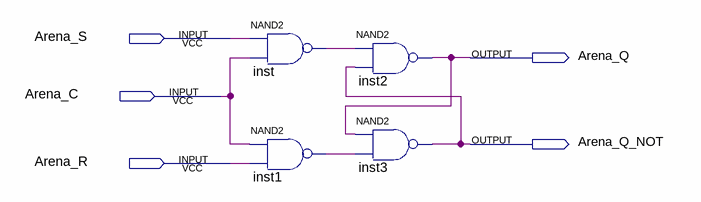
[diagram p0: schematic sheet]
// Quartus schematic Arena_Control_SRLatch.bdf as structural Verilog: 4 symbols, 5 pins
module Arena_Control_SRLatch (
  input  Arena_S,
  input  Arena_C,
  input  Arena_R,
  output Arena_Q,
  output Arena_Q_NOT
);

  wire inst1_out, inst_out;

  nand inst (inst_out, Arena_S, Arena_C);
  nand inst1 (inst1_out, Arena_C, Arena_R);
  nand inst2 (Arena_Q, inst_out, Arena_Q_NOT);
  nand inst3 (Arena_Q_NOT, Arena_Q, inst1_out);
endmodule
